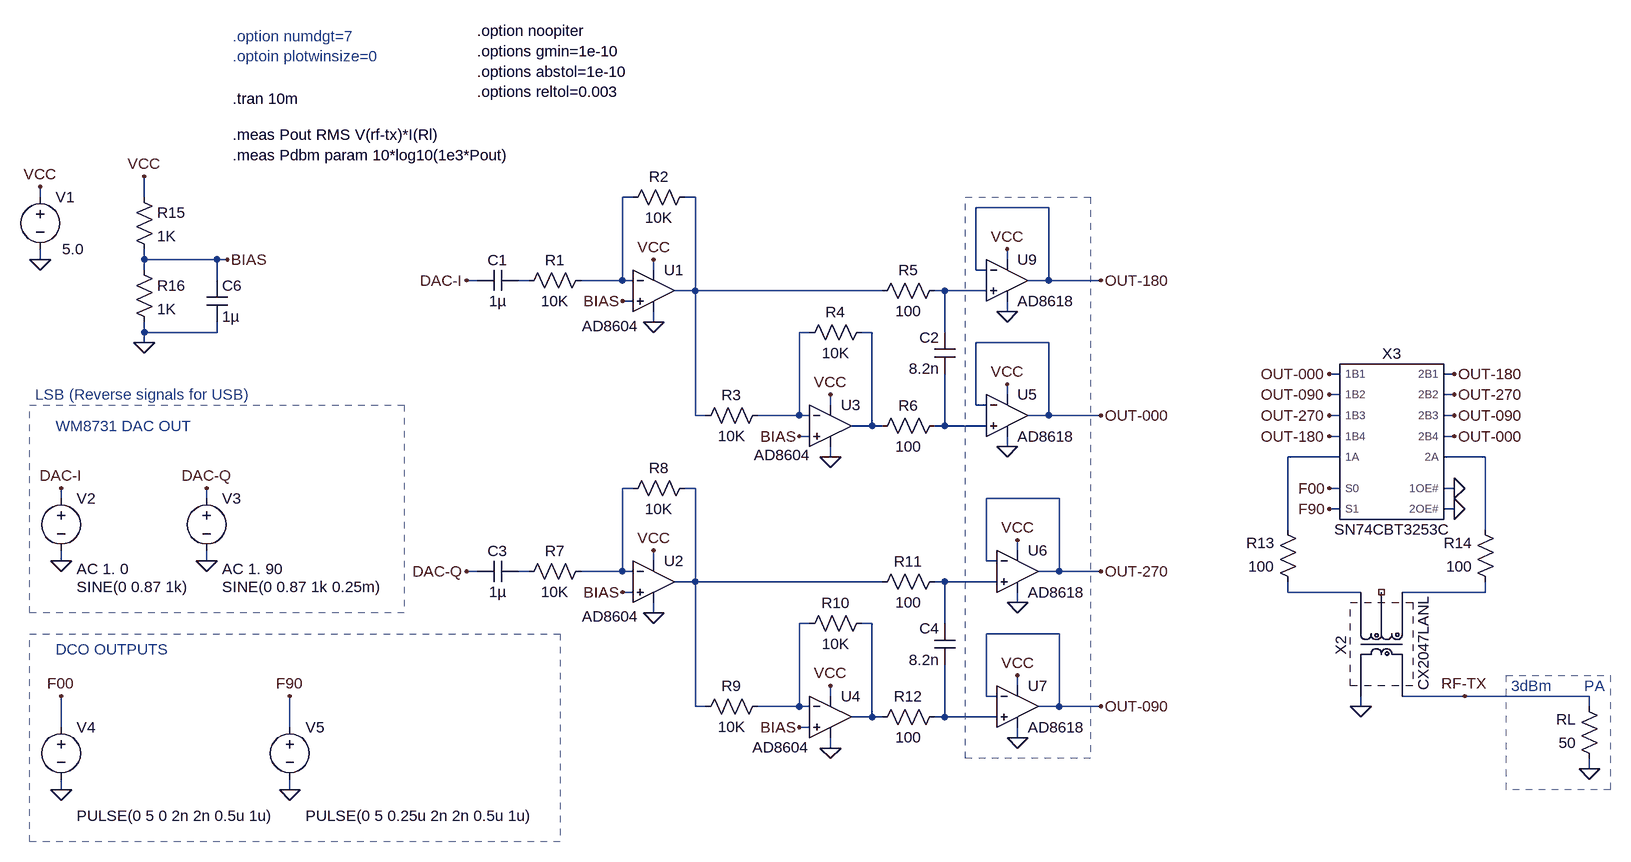
[diagram p0: schematic modulator.asc]
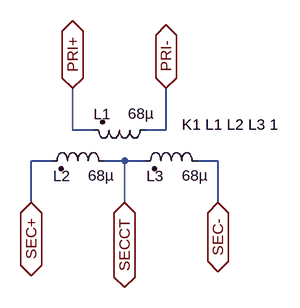
[diagram p1: sub-circuit cx2047lanl.asc]
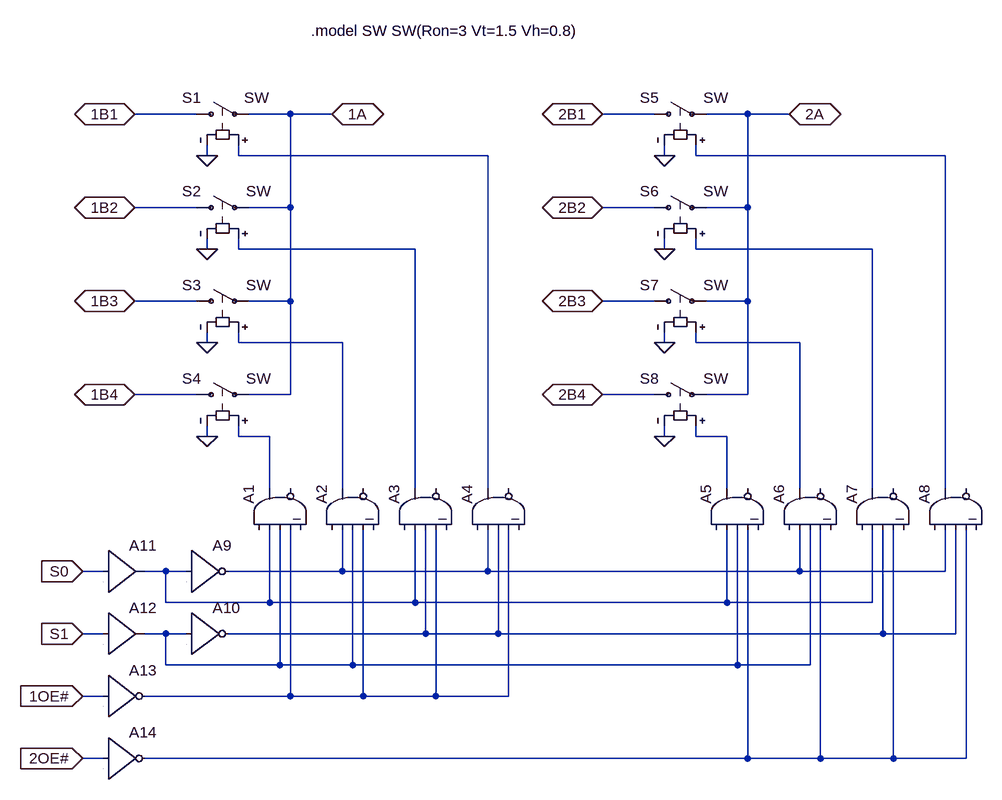
[diagram p2: sub-circuit sn74cbt3253c.asc]
modulator.asc, the LTspice schematic file:
Version 4
SHEET 1 4476 2176
WIRE 416 -128 416 -144
WIRE 576 -128 576 -160
WIRE 1328 -128 1312 -128
WIRE 1424 -128 1408 -128
WIRE 1968 -112 1856 -112
WIRE 416 -32 416 -48
WIRE 576 -32 576 -48
WIRE 688 -32 576 -32
WIRE 704 -32 688 -32
WIRE 1904 -32 1904 -48
WIRE 576 -16 576 -32
WIRE 1360 -16 1360 -32
WIRE 1856 -16 1856 -112
WIRE 1872 -16 1856 -16
WIRE 688 0 688 -32
WIRE 1088 0 1072 0
WIRE 1168 0 1152 0
WIRE 1312 0 1312 -128
WIRE 1312 0 1248 0
WIRE 1328 0 1312 0
WIRE 1968 0 1968 -112
WIRE 1968 0 1936 0
WIRE 2048 0 1968 0
WIRE 1424 16 1424 -128
WIRE 1424 16 1392 16
WIRE 1712 16 1424 16
WIRE 1808 16 1792 16
WIRE 1872 16 1808 16
WIRE 1328 32 1312 32
WIRE 1904 48 1904 32
WIRE 1360 64 1360 48
WIRE 576 80 576 64
WIRE 688 80 688 64
WIRE 688 80 576 80
WIRE 1600 80 1584 80
WIRE 1696 80 1680 80
WIRE 1808 80 1808 16
WIRE 576 96 576 80
WIRE 1968 96 1856 96
WIRE 2416 144 2400 144
WIRE 2592 144 2576 144
WIRE 1904 176 1904 160
WIRE 2416 176 2400 176
WIRE 2592 176 2576 176
WIRE 1632 192 1632 176
WIRE 1856 192 1856 96
WIRE 1872 192 1856 192
WIRE 1424 208 1424 16
WIRE 1440 208 1424 208
WIRE 1584 208 1584 80
WIRE 1584 208 1520 208
WIRE 1600 208 1584 208
WIRE 1968 208 1968 96
WIRE 1968 208 1936 208
WIRE 2048 208 1968 208
WIRE 2416 208 2400 208
WIRE 2592 208 2576 208
WIRE 1696 224 1696 80
WIRE 1696 224 1664 224
WIRE 1712 224 1696 224
WIRE 1808 224 1808 144
WIRE 1808 224 1792 224
WIRE 1872 224 1808 224
WIRE 1600 240 1584 240
WIRE 2416 240 2400 240
WIRE 2592 240 2576 240
WIRE 1904 256 1904 240
WIRE 1632 272 1632 256
WIRE 2416 272 2336 272
WIRE 2640 272 2576 272
WIRE 1328 320 1312 320
WIRE 1424 320 1408 320
WIRE 2416 320 2400 320
WIRE 2592 320 2576 320
WIRE 448 336 448 320
WIRE 672 336 672 320
WIRE 1984 336 1872 336
WIRE 2416 352 2400 352
WIRE 2592 352 2576 352
WIRE 2336 384 2336 272
WIRE 2640 384 2640 272
WIRE 1920 416 1920 400
WIRE 448 432 448 416
WIRE 672 432 672 416
WIRE 1360 432 1360 416
WIRE 1872 432 1872 336
WIRE 1888 432 1872 432
WIRE 1088 448 1072 448
WIRE 1168 448 1152 448
WIRE 1312 448 1312 320
WIRE 1312 448 1248 448
WIRE 1328 448 1312 448
WIRE 1984 448 1984 336
WIRE 1984 448 1952 448
WIRE 2048 448 1984 448
WIRE 1424 464 1424 320
WIRE 1424 464 1392 464
WIRE 1712 464 1424 464
WIRE 1808 464 1792 464
WIRE 1888 464 1808 464
WIRE 1328 480 1312 480
WIRE 2336 480 2336 464
WIRE 2448 480 2336 480
WIRE 2640 480 2640 464
WIRE 2640 480 2512 480
WIRE 1920 496 1920 480
WIRE 1360 512 1360 496
WIRE 1600 528 1584 528
WIRE 1696 528 1680 528
WIRE 1808 528 1808 464
WIRE 1984 544 1872 544
WIRE 1920 624 1920 608
WIRE 1632 640 1632 624
WIRE 1872 640 1872 544
WIRE 1888 640 1872 640
WIRE 2608 640 2512 640
WIRE 2800 640 2608 640
WIRE 1424 656 1424 464
WIRE 1440 656 1424 656
WIRE 1584 656 1584 528
WIRE 1584 656 1520 656
WIRE 1600 656 1584 656
WIRE 1984 656 1984 544
WIRE 1984 656 1952 656
WIRE 2048 656 1984 656
WIRE 2448 656 2448 640
WIRE 2800 656 2800 640
WIRE 1696 672 1696 528
WIRE 1696 672 1664 672
WIRE 1712 672 1696 672
WIRE 1808 672 1808 592
WIRE 1808 672 1792 672
WIRE 1888 672 1808 672
WIRE 448 688 448 640
WIRE 800 688 800 640
WIRE 1600 688 1584 688
WIRE 1920 704 1920 688
WIRE 1632 720 1632 704
WIRE 2800 752 2800 736
WIRE 448 784 448 768
WIRE 800 784 800 768
FLAG 576 96 0
FLAG 576 -160 VCC
FLAG 704 -32 BIAS
FLAG 448 432 0
FLAG 448 320 DAC-I
FLAG 416 -32 0
FLAG 416 -144 VCC
FLAG 1632 176 VCC
FLAG 1632 272 0
FLAG 1584 240 BIAS
FLAG 2048 0 OUT-180
FLAG 2048 208 OUT-000
FLAG 1904 256 0
FLAG 1904 48 0
FLAG 1904 -48 VCC
FLAG 1904 160 VCC
FLAG 1632 624 VCC
FLAG 1632 720 0
FLAG 1584 688 BIAS
FLAG 2048 448 OUT-270
FLAG 2048 656 OUT-090
FLAG 1920 704 0
FLAG 1920 496 0
FLAG 1920 400 VCC
FLAG 1920 608 VCC
FLAG 672 432 0
FLAG 672 320 DAC-Q
FLAG 448 784 0
FLAG 448 640 F00
FLAG 800 784 0
FLAG 800 640 F90
FLAG 2400 320 F00
FLAG 2400 352 F90
FLAG 2400 144 OUT-000
FLAG 2592 240 OUT-000
FLAG 2400 240 OUT-180
FLAG 2592 144 OUT-180
FLAG 2400 176 OUT-090
FLAG 2592 208 OUT-090
FLAG 2400 208 OUT-270
FLAG 2592 176 OUT-270
FLAG 2592 320 0
FLAG 2592 352 0
FLAG 2448 656 0
FLAG 2800 752 0
FLAG 2608 640 RF-TX
FLAG 1360 416 VCC
FLAG 1360 512 0
FLAG 1312 480 BIAS
FLAG 1360 -32 VCC
FLAG 1360 64 0
FLAG 1312 32 BIAS
FLAG 1072 0 DAC-I
FLAG 1072 448 DAC-Q
SYMBOL res 560 -144 R0
SYMATTR InstName R15
SYMATTR Value 1K
SYMATTR SpiceLine tol=0.1
SYMBOL res 560 -32 R0
SYMATTR InstName R16
SYMATTR Value 1K
SYMATTR SpiceLine tol=0.1
SYMBOL cap 672 0 R0
SYMATTR InstName C6
SYMATTR Value 1µ
SYMBOL voltage 448 320 R0
WINDOW 3 24 152 Left 2
WINDOW 123 24 124 Left 2
WINDOW 39 24 44 Left 2
SYMATTR Value SINE(0 0.87 1k)
SYMATTR Value2 AC 1. 0
SYMATTR InstName V2
SYMBOL voltage 416 -144 R0
WINDOW 3 34 96 Left 2
WINDOW 123 24 124 Left 2
WINDOW 39 0 0 Left 0
SYMATTR Value 5.0
SYMATTR InstName V1
SYMBOL res 1536 192 R90
WINDOW 0 0 56 VBottom 2
WINDOW 3 32 56 VTop 2
SYMATTR InstName R3
SYMATTR Value 10K
SYMATTR SpiceLine tol=0.1
SYMBOL res 1696 64 R90
WINDOW 0 0 56 VBottom 2
WINDOW 3 32 56 VTop 2
SYMATTR InstName R4
SYMATTR Value 10K
SYMATTR SpiceLine tol=0.1
SYMBOL res 1536 640 R90
WINDOW 0 0 56 VBottom 2
WINDOW 3 32 56 VTop 2
SYMATTR InstName R9
SYMATTR Value 10K
SYMATTR SpiceLine tol=0.1
SYMBOL res 1696 512 R90
WINDOW 0 0 56 VBottom 2
WINDOW 3 32 56 VTop 2
SYMATTR InstName R10
SYMATTR Value 10K
SYMATTR SpiceLine tol=0.1
SYMBOL voltage 672 320 R0
WINDOW 3 24 152 Left 2
WINDOW 123 24 124 Left 2
WINDOW 39 24 44 Left 2
SYMATTR Value SINE(0 0.87 1k 0.25m)
SYMATTR Value2 AC 1. 90
SYMATTR InstName V3
SYMBOL voltage 448 672 R0
WINDOW 3 24 152 Left 2
WINDOW 123 24 124 Left 2
WINDOW 39 24 44 Left 2
SYMATTR Value PULSE(0 5 0 2n 2n 0.5u 1u)
SYMATTR InstName V4
SYMBOL voltage 800 672 R0
WINDOW 3 24 152 Left 2
WINDOW 123 24 124 Left 2
WINDOW 39 24 44 Left 2
SYMATTR Value PULSE(0 5 0.25u 2n 2n 0.5u 1u)
SYMATTR InstName V5
SYMBOL res 2816 752 R180
WINDOW 0 36 76 Left 2
WINDOW 3 36 40 Left 2
SYMATTR InstName RL
SYMATTR Value 50
SYMATTR SpiceLine tol=0.1
SYMBOL res 2352 480 R180
WINDOW 0 36 76 Left 2
WINDOW 3 36 40 Left 2
SYMATTR InstName R13
SYMATTR Value 100
SYMATTR SpiceLine tol=0.1
SYMBOL res 2656 480 R180
WINDOW 0 36 76 Left 2
WINDOW 3 36 40 Left 2
SYMATTR InstName R14
SYMATTR Value 100
SYMATTR SpiceLine tol=0.1
SYMBOL res 1424 304 R90
WINDOW 0 0 56 VBottom 2
WINDOW 3 32 56 VTop 2
SYMATTR InstName R8
SYMATTR Value 10K
SYMATTR SpiceLine tol=0.1
SYMBOL res 1424 -144 R90
WINDOW 0 0 56 VBottom 2
WINDOW 3 32 56 VTop 2
SYMATTR InstName R2
SYMATTR Value 10K
SYMATTR SpiceLine tol=0.1
SYMBOL res 1264 -16 R90
WINDOW 0 0 56 VBottom 2
WINDOW 3 32 56 VTop 2
SYMATTR InstName R1
SYMATTR Value 10K
SYMATTR SpiceLine tol=0.1
SYMBOL res 1264 432 R90
WINDOW 0 0 56 VBottom 2
WINDOW 3 32 56 VTop 2
SYMATTR InstName R7
SYMATTR Value 10K
SYMATTR SpiceLine tol=0.1
SYMBOL cap 1152 -16 R90
WINDOW 0 0 32 VBottom 2
WINDOW 3 32 32 VTop 2
SYMATTR InstName C1
SYMATTR Value 1µ
SYMBOL cap 1152 432 R90
WINDOW 0 0 32 VBottom 2
WINDOW 3 32 32 VTop 2
SYMATTR InstName C3
SYMATTR Value 1µ
SYMBOL Opamps\\AD8604 1360 -48 R0
WINDOW 3 -23 118 Right 2
SYMATTR InstName U1
SYMBOL Opamps\\AD8604 1360 400 R0
WINDOW 3 -23 117 Right 2
SYMATTR InstName U2
SYMBOL Opamps\\AD8604 1632 160 R0
WINDOW 3 -118 109 Left 2
SYMATTR InstName U3
SYMBOL Opamps\\AD8604 1632 608 R0
WINDOW 3 -120 111 Left 2
SYMATTR InstName U4
SYMBOL res 1808 208 R90
WINDOW 0 0 56 VBottom 2
WINDOW 3 32 56 VTop 2
SYMATTR InstName R6
SYMATTR Value 100
SYMATTR SpiceLine tol=0.1
SYMBOL res 1808 0 R90
WINDOW 0 0 56 VBottom 2
WINDOW 3 32 56 VTop 2
SYMATTR InstName R5
SYMATTR Value 100
SYMATTR SpiceLine tol=0.1
SYMBOL res 1808 656 R90
WINDOW 0 0 56 VBottom 2
WINDOW 3 32 56 VTop 2
SYMATTR InstName R12
SYMATTR Value 100
SYMATTR SpiceLine tol=0.1
SYMBOL res 1808 448 R90
WINDOW 0 0 56 VBottom 2
WINDOW 3 32 56 VTop 2
SYMATTR InstName R11
SYMATTR Value 100
SYMATTR SpiceLine tol=0.1
SYMBOL cap 1824 144 R180
WINDOW 0 24 56 Left 2
WINDOW 3 24 8 Left 2
SYMATTR InstName C2
SYMATTR Value 8.2n
SYMBOL cap 1824 592 R180
WINDOW 0 24 56 Left 2
WINDOW 3 24 8 Left 2
SYMATTR InstName C4
SYMATTR Value 8.2n
SYMBOL CX2047LANL 2480 560 R90
WINDOW 0 2 47 Top 2
WINDOW 3 -2 -49 Bottom 2
SYMATTR InstName X2
SYMBOL SN74CBT3253C 2496 256 R0
SYMATTR InstName X3
SYMBOL Opamps\\AD8618 1904 -64 R0
SYMATTR InstName U9
SYMBOL Opamps\\AD8618 1904 144 R0
SYMATTR InstName U5
SYMBOL Opamps\\AD8618 1920 384 R0
SYMATTR InstName U6
SYMBOL Opamps\\AD8618 1920 592 R0
SYMATTR InstName U7
TEXT 712 -280 Left 2 !.tran 10m
TEXT 440 224 Left 2 ;WM8731 DAC OUT
TEXT 440 568 Left 2 ;DCO OUTPUTS
TEXT 712 -376 Left 2 ;.option numdgt=7\n.optoin plotwinsize=0
TEXT 408 176 Left 2 ;LSB (Reverse signals for USB)
TEXT 2792 624 Left 2 ;PA
TEXT 2680 624 Left 2 ;3dBm
TEXT 712 -224 Left 2 !.meas Pout RMS V(rf-tx)*I(Rl)\n.meas Pdbm param 10*log10(1e3*Pout)
TEXT 1088 -384 Left 2 !.option noopiter\n.options gmin=1e-10\n.options abstol=1e-10\n.options reltol=0.003
RECTANGLE Normal 2032 736 1840 -128 2
RECTANGLE Normal 2832 784 2672 608 2
RECTANGLE Normal 1216 864 400 544 2
RECTANGLE Normal 976 512 400 192 2

cx2047lanl.asc, the sub-circuit schematic file:
Version 4
SHEET 1 880 680
WIRE 16 112 16 48
WIRE 48 112 16 112
WIRE 160 112 160 48
WIRE 160 112 128 112
WIRE -16 160 -48 160
WIRE 96 160 64 160
WIRE 128 160 96 160
WIRE 240 160 208 160
WIRE -48 224 -48 160
WIRE 96 224 96 160
WIRE 240 224 240 160
FLAG 16 48 PRI+
IOPIN 16 48 BiDir
FLAG 160 48 PRI-
IOPIN 160 48 BiDir
FLAG 96 224 SECCT
IOPIN 96 224 BiDir
FLAG 240 224 SEC-
IOPIN 240 224 BiDir
FLAG -48 224 SEC+
IOPIN -48 224 BiDir
SYMBOL ind2 144 96 R90
WINDOW 0 -8 69 VRight 2
WINDOW 3 -9 43 VLeft 2
SYMATTR InstName L1
SYMATTR Value 68µ
SYMATTR Type ind
SYMBOL ind2 80 176 M270
WINDOW 0 -7 67 VRight 2
WINDOW 3 -6 40 VLeft 2
SYMATTR InstName L2
SYMATTR Value 68µ
SYMATTR Type ind
SYMBOL ind2 224 176 M270
WINDOW 0 -7 67 VRight 2
WINDOW 3 -6 40 VLeft 2
SYMATTR InstName L3
SYMATTR Value 68µ
SYMATTR Type ind
TEXT 184 104 Left 2 !K1 L1 L2 L3 1

sn74cbt3253c.asc, the sub-circuit schematic file:
Version 4
SHEET 1 1616 1176
WIRE 48 112 -48 112
WIRE 192 112 128 112
WIRE 256 112 192 112
WIRE 752 112 672 112
WIRE 896 112 832 112
WIRE 960 112 896 112
WIRE 64 176 64 160
WIRE 112 176 112 160
WIRE 496 176 112 176
WIRE 768 176 768 160
WIRE 816 176 816 160
WIRE 1200 176 816 176
WIRE 48 256 -48 256
WIRE 192 256 192 112
WIRE 192 256 128 256
WIRE 752 256 672 256
WIRE 896 256 896 112
WIRE 896 256 832 256
WIRE 64 320 64 304
WIRE 112 320 112 304
WIRE 384 320 112 320
WIRE 768 320 768 304
WIRE 816 320 816 304
WIRE 1088 320 816 320
WIRE 48 400 -48 400
WIRE 192 400 192 256
WIRE 192 400 128 400
WIRE 752 400 672 400
WIRE 896 400 896 256
WIRE 896 400 832 400
WIRE 64 464 64 448
WIRE 112 464 112 448
WIRE 272 464 112 464
WIRE 768 464 768 448
WIRE 816 464 816 448
WIRE 976 464 816 464
WIRE 48 544 -48 544
WIRE 192 544 192 400
WIRE 192 544 128 544
WIRE 752 544 672 544
WIRE 896 544 896 400
WIRE 896 544 832 544
WIRE 64 608 64 592
WIRE 112 608 112 592
WIRE 160 608 112 608
WIRE 768 608 768 592
WIRE 816 608 816 592
WIRE 864 608 816 608
WIRE 160 688 160 608
WIRE 272 688 272 464
WIRE 384 688 384 320
WIRE 496 688 496 176
WIRE 864 688 864 608
WIRE 976 688 976 464
WIRE 1088 688 1088 320
WIRE 1200 688 1200 176
WIRE -96 816 -128 816
WIRE 0 816 -32 816
WIRE 32 816 0 816
WIRE 272 816 272 752
WIRE 272 816 96 816
WIRE 496 816 496 752
WIRE 496 816 272 816
WIRE 976 816 976 752
WIRE 976 816 496 816
WIRE 1200 816 1200 752
WIRE 1200 816 976 816
WIRE 0 864 0 816
WIRE 160 864 160 752
WIRE 160 864 0 864
WIRE 384 864 384 752
WIRE 384 864 160 864
WIRE 864 864 864 752
WIRE 864 864 384 864
WIRE 1088 864 1088 752
WIRE 1088 864 864 864
WIRE -96 912 -128 912
WIRE 0 912 -32 912
WIRE 32 912 0 912
WIRE 400 912 400 752
WIRE 400 912 96 912
WIRE 512 912 512 752
WIRE 512 912 400 912
WIRE 1104 912 1104 752
WIRE 1104 912 512 912
WIRE 1216 912 1216 752
WIRE 1216 912 1104 912
WIRE 0 960 0 912
WIRE 176 960 176 752
WIRE 176 960 0 960
WIRE 288 960 288 752
WIRE 288 960 176 960
WIRE 880 960 880 752
WIRE 880 960 288 960
WIRE 992 960 992 752
WIRE 992 960 880 960
WIRE -96 1008 -128 1008
WIRE 192 1008 192 752
WIRE 192 1008 -32 1008
WIRE 304 1008 304 752
WIRE 304 1008 192 1008
WIRE 416 1008 416 752
WIRE 416 1008 304 1008
WIRE 528 1008 528 752
WIRE 528 1008 416 1008
WIRE -96 1104 -128 1104
WIRE 896 1104 896 752
WIRE 896 1104 -32 1104
WIRE 1008 1104 1008 752
WIRE 1008 1104 896 1104
WIRE 1120 1104 1120 752
WIRE 1120 1104 1008 1104
WIRE 1232 1104 1232 752
WIRE 1232 1104 1120 1104
FLAG 256 112 1A
IOPIN 256 112 BiDir
FLAG 672 112 2B1
IOPIN 672 112 BiDir
FLAG 672 256 2B2
IOPIN 672 256 BiDir
FLAG 672 400 2B3
IOPIN 672 400 BiDir
FLAG 672 544 2B4
IOPIN 672 544 BiDir
FLAG 960 112 2A
IOPIN 960 112 BiDir
FLAG -128 816 S0
IOPIN -128 816 In
FLAG -128 912 S1
IOPIN -128 912 In
FLAG -128 1008 1OE#
IOPIN -128 1008 In
FLAG -128 1104 2OE#
IOPIN -128 1104 In
FLAG 64 608 0
FLAG 64 176 0
FLAG 64 320 0
FLAG 64 464 0
FLAG 768 176 0
FLAG 768 320 0
FLAG 768 464 0
FLAG 768 608 0
FLAG -48 112 1B1
IOPIN -48 112 BiDir
FLAG -48 256 1B2
IOPIN -48 256 BiDir
FLAG -48 400 1B3
IOPIN -48 400 BiDir
FLAG -48 544 1B4
IOPIN -48 544 BiDir
SYMBOL sw 32 112 R270
WINDOW 0 25 23 VLeft 2
WINDOW 3 25 89 VRight 2
SYMATTR InstName S1
SYMBOL sw 32 256 R270
WINDOW 0 25 23 VLeft 2
WINDOW 3 25 92 VRight 2
SYMATTR InstName S2
SYMBOL sw 32 400 R270
WINDOW 0 25 23 VLeft 2
WINDOW 3 25 92 VRight 2
SYMATTR InstName S3
SYMBOL sw 32 544 R270
WINDOW 0 25 23 VLeft 2
WINDOW 3 25 92 VRight 2
SYMATTR InstName S4
SYMBOL sw 736 112 R270
WINDOW 0 25 23 VLeft 2
WINDOW 3 25 92 VRight 2
SYMATTR InstName S5
SYMBOL sw 736 256 R270
WINDOW 0 25 23 VLeft 2
WINDOW 3 25 92 VRight 2
SYMATTR InstName S6
SYMBOL sw 736 400 R270
WINDOW 0 25 23 VLeft 2
WINDOW 3 25 92 VRight 2
SYMATTR InstName S7
SYMBOL sw 736 544 R270
WINDOW 0 25 23 VLeft 2
WINDOW 3 25 92 VRight 2
SYMATTR InstName S8
SYMBOL Digital\\and 112 720 R270
WINDOW 3 0 0 Invisible 0
SYMATTR InstName A1
SYMATTR Value Vhigh=2.7 Vlow=0.4
SYMBOL Digital\\and 224 720 R270
WINDOW 3 0 0 Invisible 0
SYMATTR InstName A2
SYMATTR Value Vhigh=2.7 Vlow=0.4
SYMBOL Digital\\and 336 720 R270
WINDOW 3 0 0 Invisible 0
SYMATTR InstName A3
SYMATTR Value Vhigh=2.7 Vlow=0.4
SYMBOL Digital\\and 448 720 R270
WINDOW 3 0 0 Invisible 0
SYMATTR InstName A4
SYMATTR Value Vhigh=2.7 Vlow=0.4
SYMBOL Digital\\and 816 720 R270
WINDOW 3 0 0 Invisible 0
SYMATTR InstName A5
SYMATTR Value Vhigh=2.7 Vlow=0.4
SYMBOL Digital\\and 928 720 R270
WINDOW 3 0 0 Invisible 0
SYMATTR InstName A6
SYMATTR Value Vhigh=2.7 Vlow=0.4
SYMBOL Digital\\and 1040 720 R270
WINDOW 3 0 0 Invisible 0
SYMATTR InstName A7
SYMATTR Value Vhigh=2.7 Vlow=0.4
SYMBOL Digital\\and 1152 720 R270
WINDOW 3 0 0 Invisible 0
SYMATTR InstName A8
SYMATTR Value Vhigh=2.7 Vlow=0.4
SYMBOL Digital\\inv 32 752 R0
WINDOW 3 0 0 Invisible 0
SYMATTR InstName A9
SYMATTR Value Vhigh=2.7 Vlow=0.4
SYMBOL Digital\\inv 32 848 R0
WINDOW 3 0 0 Invisible 0
SYMATTR InstName A10
SYMATTR Value Vhigh=2.7 Vlow=0.4
SYMBOL Digital\\buf1 -96 752 R0
WINDOW 3 0 0 Invisible 0
SYMATTR InstName A11
SYMATTR Value Vhigh=2.7 Vlow=0.4
SYMBOL Digital\\buf1 -96 848 R0
WINDOW 3 0 0 Invisible 0
SYMATTR InstName A12
SYMATTR Value Vhigh=2.7 Vlow=0.4
SYMBOL Digital\\inv -96 944 R0
WINDOW 3 0 0 Invisible 0
SYMATTR InstName A13
SYMATTR Value Vhigh=2.7 Vlow=0.4
SYMBOL Digital\\inv -96 1040 R0
WINDOW 3 0 0 Invisible 0
SYMATTR InstName A14
SYMATTR Value Vhigh=2.7 Vlow=0.4
TEXT 224 -16 Left 2 !.model SW SW(Ron=3 Vt=1.5 Vh=0.8)

The netlist it stands for:
* modulator.asc
R15 VCC BIAS 1K tol=0.1
R16 BIAS 0 1K tol=0.1
C6 BIAS 0 1µ
V2 DAC-I 0 SINE(0 0.87 1k) AC 1. 0
V1 VCC 0 5.0
R3 N005 N002 10K tol=0.1
R4 N006 N005 10K tol=0.1
R9 N016 N011 10K tol=0.1
R10 N017 N016 10K tol=0.1
V3 DAC-Q 0 SINE(0 0.87 1k 0.25m) AC 1. 90
V4 F00 0 PULSE(0 5 0 2n 2n 0.5u 1u)
V5 F90 0 PULSE(0 5 0.25u 2n 2n 0.5u 1u)
RL 0 RF-TX 50 tol=0.1
R13 N014 N008 100 tol=0.1
R14 N015 N009 100 tol=0.1
R8 N011 N010 10K tol=0.1
R2 N002 N001 10K tol=0.1
R1 N001 N003 10K tol=0.1
R7 N010 N012 10K tol=0.1
C1 N003 DAC-I 1µ
C3 N012 DAC-Q 1µ
XU1 BIAS N001 VCC 0 N002 AD8604  ; pins In+ In- V+ V- OUT
XU2 BIAS N010 VCC 0 N011 AD8604  ; pins In+ In- V+ V- OUT
XU3 BIAS N005 VCC 0 N006 AD8604  ; pins In+ In- V+ V- OUT
XU4 BIAS N016 VCC 0 N017 AD8604  ; pins In+ In- V+ V- OUT
R6 N007 N006 100 tol=0.1
R5 N004 N002 100 tol=0.1
R12 N018 N017 100 tol=0.1
R11 N013 N011 100 tol=0.1
C2 N007 N004 8.2n
C4 N018 N013 8.2n
XX2 N015 NC_01 N014 RF-TX 0 cx2047lanl params: CX2047LANL
XX3 OUT-000 OUT-090 OUT-270 OUT-180 N008 F00 F90 0 0 N009 OUT-000 OUT-090 OUT-270 OUT-180 sn74cbt3253c params: SN74CBT3253C
XU9 N004 OUT-180 VCC 0 OUT-180 AD8618  ; pins In+ In- V+ V- OUT
XU5 N007 OUT-000 VCC 0 OUT-000 AD8618  ; pins In+ In- V+ V- OUT
XU6 N013 OUT-270 VCC 0 OUT-270 AD8618  ; pins In+ In- V+ V- OUT
XU7 N018 OUT-090 VCC 0 OUT-090 AD8618  ; pins In+ In- V+ V- OUT

* block symbol definitions
.subckt cx2047lanl SEC+ SECCT SEC- PRI+ PRI-
L1 PRI- PRI+ 68µ
L2 SECCT SEC+ 68µ
L3 SEC- SECCT 68µ
K1 L1 L2 L3 1
.ends cx2047lanl

.subckt sn74cbt3253c 1B1 1B2 1B3 1B4 1A S0 S1 2OE# 1OE# 2A 2B4 2B3 2B2 2B1
S1 1B1 1A N001 0 SW
S2 1B2 1A N003 0 SW
S3 1B3 1A N005 0 SW
S4 1B4 1A N007 0 SW
S5 2B1 2A N002 0 SW
S6 2B2 2A N004 0 SW
S7 2B3 2A N006 0 SW
S8 2B4 2A N008 0 SW
A1 0 N009 N011 N013 0 0 N007 0 AND Vhigh=2.7 Vlow=0.4
A2 0 N010 N011 N013 0 0 N005 0 AND Vhigh=2.7 Vlow=0.4
A3 0 N009 N012 N013 0 0 N003 0 AND Vhigh=2.7 Vlow=0.4
A4 0 N010 N012 N013 0 0 N001 0 AND Vhigh=2.7 Vlow=0.4
A5 0 N009 N011 N014 0 0 N008 0 AND Vhigh=2.7 Vlow=0.4
A6 0 N010 N011 N014 0 0 N006 0 AND Vhigh=2.7 Vlow=0.4
A7 0 N009 N012 N014 0 0 N004 0 AND Vhigh=2.7 Vlow=0.4
A8 0 N010 N012 N014 0 0 N002 0 AND Vhigh=2.7 Vlow=0.4
A9 N009 0 0 0 0 N010 0 0 BUF Vhigh=2.7 Vlow=0.4
A10 N011 0 0 0 0 N012 0 0 BUF Vhigh=2.7 Vlow=0.4
A11 S0 0 0 0 0 0 N009 0 BUF Vhigh=2.7 Vlow=0.4
A12 S1 0 0 0 0 0 N011 0 BUF Vhigh=2.7 Vlow=0.4
A13 1OE# 0 0 0 0 N013 0 0 BUF Vhigh=2.7 Vlow=0.4
A14 2OE# 0 0 0 0 N014 0 0 BUF Vhigh=2.7 Vlow=0.4
.model SW SW(Ron=3 Vt=1.5 Vh=0.8)
.ends sn74cbt3253c

.tran 10m
* WM8731 DAC OUT
* DCO OUTPUTS
* .option numdgt=7
* .optoin plotwinsize=0
* LSB (Reverse signals for USB)
* PA
* 3dBm
.meas Pout RMS V(rf-tx)*I(Rl)
.meas Pdbm param 10*log10(1e3*Pout)
.option noopiter
.options gmin=1e-10
.options abstol=1e-10
.options reltol=0.003
.backanno
.end